# Altium project STM32_MICROCONTROLLER.PrjPcb
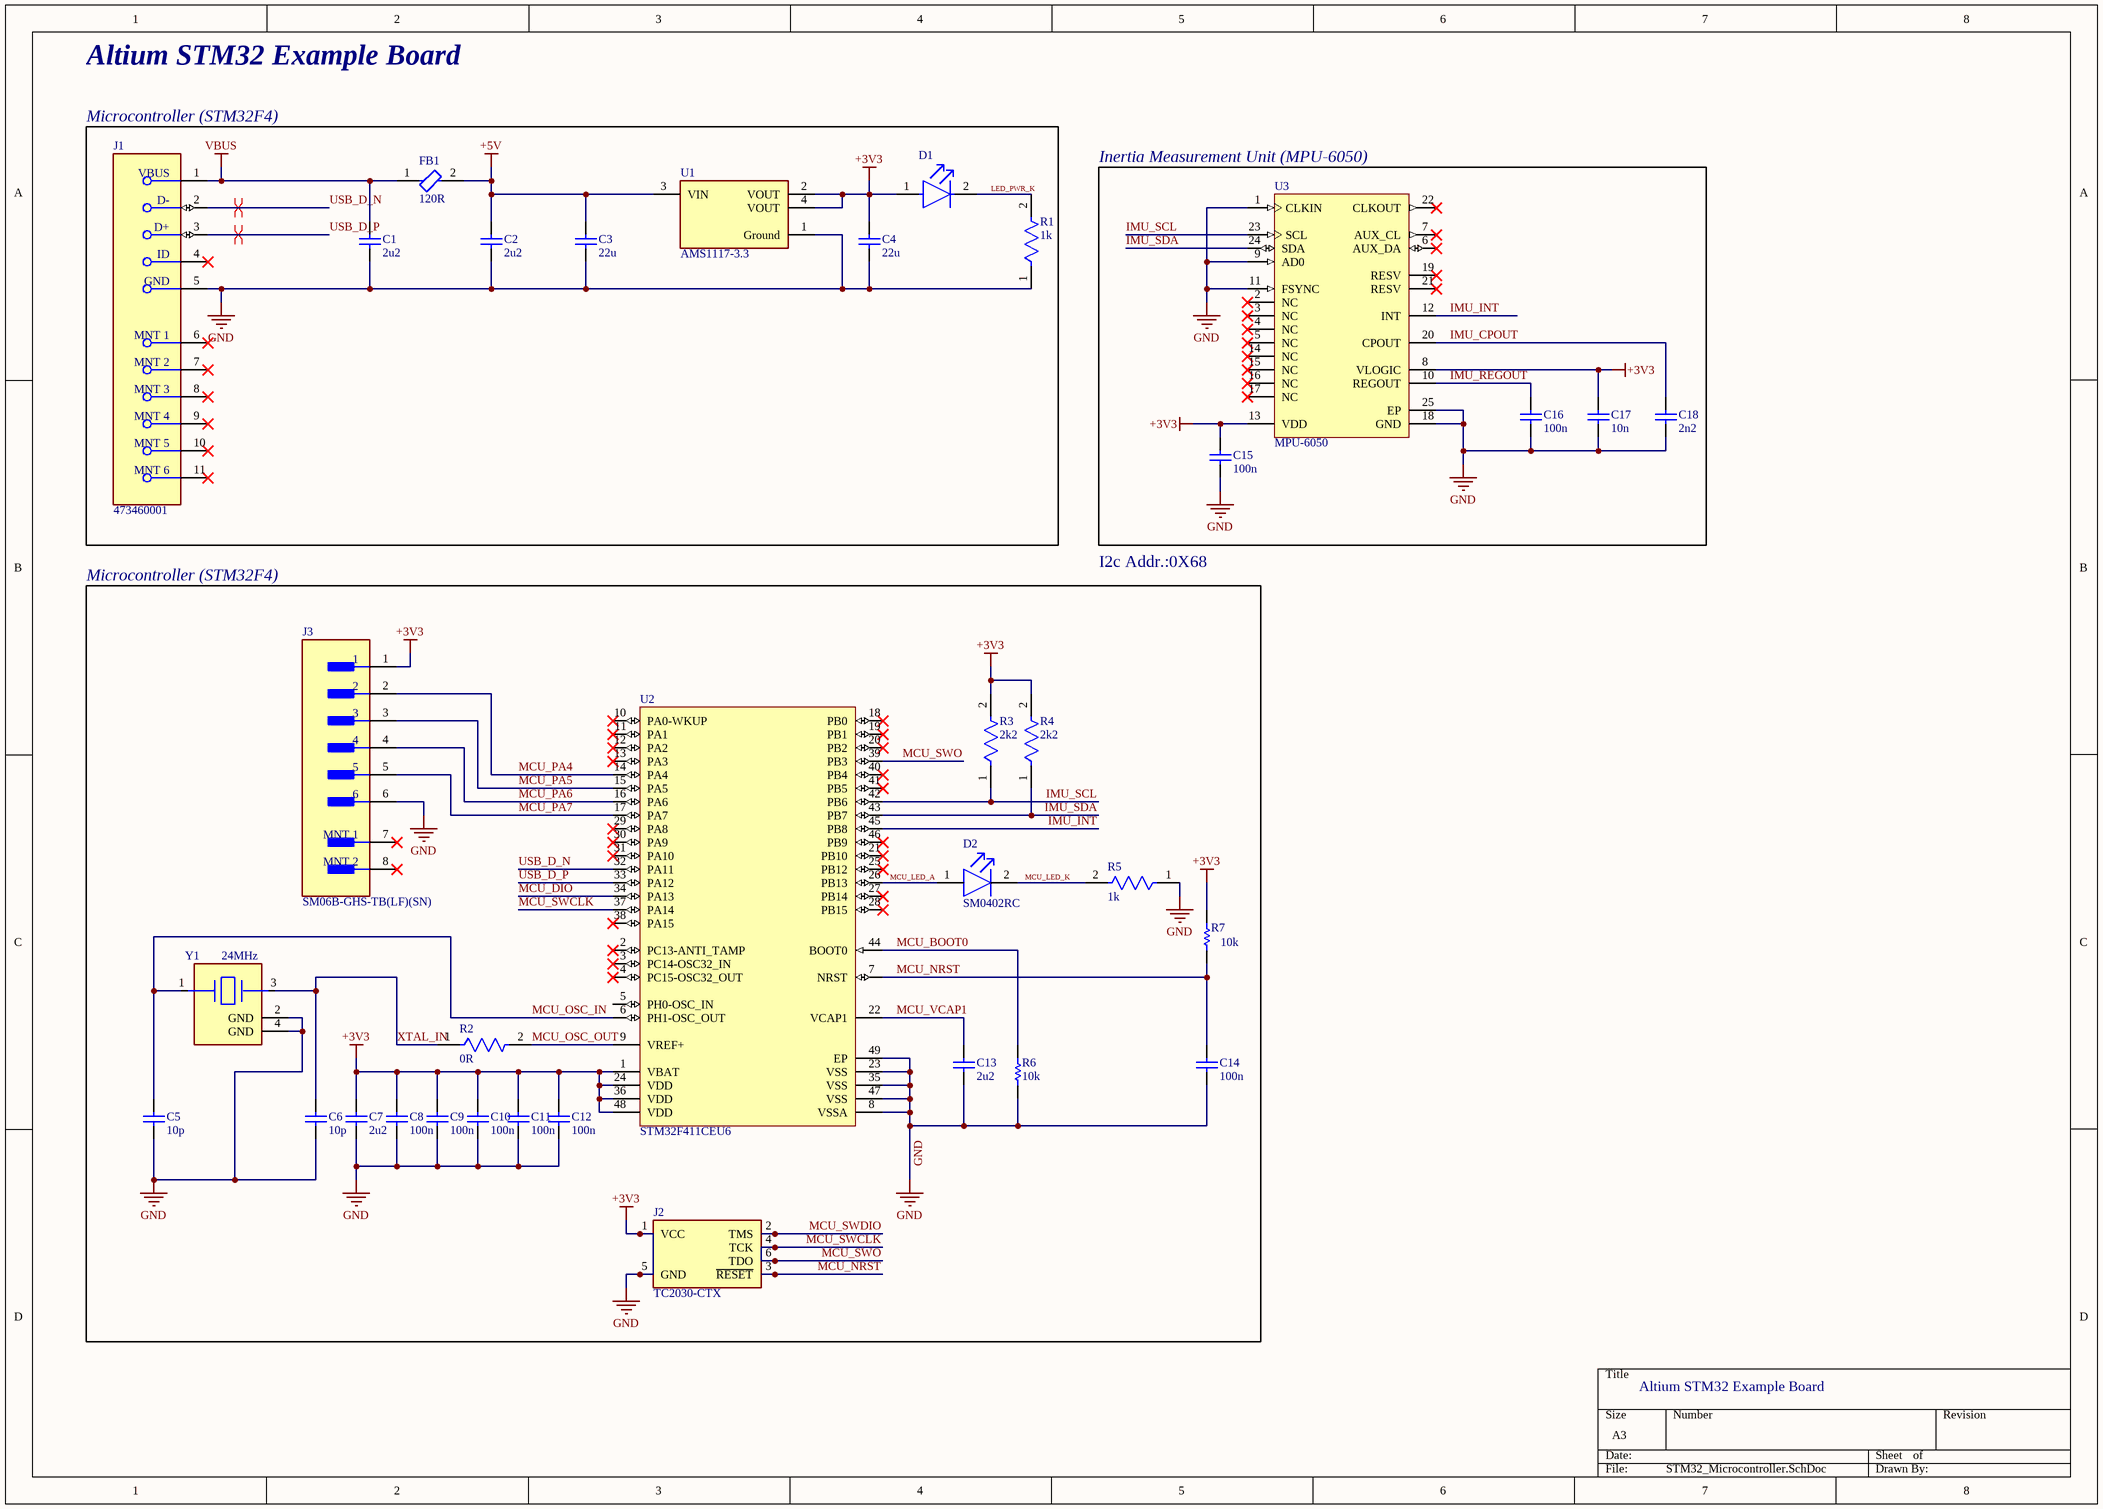
[diagram p0: STM32_Microcontroller.SchDoc]
1 sheet, 35 parts. Net scope: global (net labels, ports and power ports of the same name join across sheets).
Board file: STM32_MICROCONTROLLER.PcbDoc

## Sheet STM32_Microcontroller.SchDoc
size A3; SheetNumber: 1; SheetTotal: 1

### Parts
C1  2u2  [CAPC1608X95X40ML15T15]
C2  2u2  [CAPC1608X95X40ML15T15]
C3  22u  [CAPC2013X140X50NL20T25]
C4  22u  [CAPC2013X140X50NL20T25]
C5  10p  [CAPC1005X60X30NL05T10]
C6  10p  [CAPC1005X60X30NL05T10]
C7  2u2  [CAPC1608X95X40ML15T15]
C8  100n  [CAPC1005X56X25LL10T15]
C9  100n  [CAPC1005X56X25LL10T15]
C10  100n  [CAPC1005X56X25LL10T15]
C11  100n  [CAPC1005X56X25LL10T15]
C12  100n  [CAPC1005X56X25LL10T15]
C13  2u2  [CAPC1608X95X40ML15T15]
C14  100n  [CAPC1005X56X25LL10T15]
C15  100n  [CAPC1005X56X25LL10T15]
C16  100n  [CAPC1005X56X25LL10T15]
C17  10n  [CAPC1005X56X25LL10T15]
C18  2n2  [CAPC1005X56X25LL10T15]
D1  SM0402GC  [FP-SM0402GC-MFG]  (value not drawn)
D2  SM0402RC  [FP-SM0402RC-MFG]
FB1  120R  [FP-BLM18-0_15-t0_8-IPC_B]
J1  473460001  [FP-473460001-MFG]
J2  TC2030-CTX  [TC2030-IDC-NL]
J3  SM06B-GHS-TB(LF)(SN)  [FP-SM06B-GHS-TB_LF_SN-MFG]
R1  1k  [FP-RMCF0402-IPC_A]
R2  0R  [FP-RMCF0402-IPC_A]
R3  2k2  [FP-RMCF0402-IPC_A]
R4  2k2  [FP-RMCF0402-IPC_A]
R5  1k  [FP-RMCF0402-IPC_A]
R6  10k  [RESC1005X40X25LL10T10]
R7  10k  [RESC1005X40X25LL10T10]
U1  AMS1117-3.3  [FP-AMS1117-IPC_C]
U2  STM32F411CEU6  [STM-UFQFPN48_L]
U3  MPU-6050  [IS-QFN-24_V]
Y1  24MHz  [FP-TSX-3225-MFG]

### Blocks framed on the sheet
Microcontroller (STM32F4): C1-C4 D1 FB1 J1 R1 U1
Inertia Measurement Unit (MPU-6050): C15-C18 U3

### Nets
+5V: C2.2 C3.2 FB1.2 U1.3(VIN)
GND: C1.1 C2.1 C3.1 C4.1 C4.2 C5.1 C6.1 C7.1 C7.2 C8.1 C8.2 C9.1 C9.2 C10.1 C10.2 C11.1 C11.2 C12.1 C12.2 C13.1 C14.1 C15.1 C15.2 C16.1 C17.1 C17.2 C18.2 D1.1(A) J1.5(GND) J2.1(VCC) J2.5(GND) J3.1 J3.6 R1.1 R3.2 R4.2 R5.1 R6.1 R7.2 U1.1(Ground) U1.2(VOUT) U1.4(VOUT) U2.1(VBAT) U2.8(VSSA) U2.23(VSS) U2.24(VDD) U2.35(VSS) U2.36(VDD) U2.47(VSS) U2.48(VDD) U2.49(EP) U3.1(CLKIN) U3.8(VLOGIC) U3.9(AD0) U3.11(FSYNC) U3.13(VDD) U3.18(GND) U3.25(EP) Y1.2(GND) Y1.4(GND)  [also labelled +3V3]
VBUS: C1.2 FB1.1 J1.1(VBUS)
IMU_CPOUT: C18.1 U3.20(CPOUT)
IMU_INT: U2.45(PB8) U3.12(INT)
IMU_REGOUT: C16.2 U3.10(REGOUT)
IMU_SCL: R3.1 U2.42(PB6) U3.23(SCL)
IMU_SDA: R4.1 U2.43(PB7) U3.24(SDA)
LED_PWR_K: D1.2(C) R1.2
MCU_BOOT0: R6.2 U2.44(BOOT0)
MCU_DIO: U2.34(PA13)
MCU_LED_A: D2.1(A) U2.26(PB13)
MCU_LED_K: D2.2(C) R5.2
MCU_NRST: C14.2 J2.3(~{RESET}) R7.1 U2.7(NRST)
MCU_OSC_IN: C5.2 U2.6(PH1-OSC_OUT) Y1.1
MCU_OSC_OUT: R2.2 U2.9(VREF+)
MCU_PA4: J3.2 U2.14(PA4)
MCU_PA5: J3.3 U2.15(PA5)
MCU_PA6: J3.4 U2.16(PA6)
MCU_PA7: J3.5 U2.17(PA7)
MCU_SWCLK: J2.4(TCK) J2.6(TDO) U2.37(PA14) U2.39(PB3)  [also labelled MCU_SWO]
MCU_SWDIO: J2.2(TMS)
MCU_VCAP1: C13.2 U2.22(VCAP1)
USB_D_N: J1.2(D-) U2.32(PA11)
USB_D_P: J1.3(D+) U2.33(PA12)
XTAL_IN: C6.2 R2.1 Y1.3

Not connected (* = marked no-connect by the designer): J1 4(ID)* 6(MNT_1)* 7(MNT_2)* 8(MNT_3)* 9(MNT_4)* 10(MNT_5)* 11(MNT_6)*; J3 7(MNT_1)* 8(MNT_2)*; U2 2(PC13-ANTI_TAMP)* 3(PC14-OSC32_IN)* 4(PC15-OSC32_OUT)* 5(PH0-OSC_IN) 10(PA0-WKUP)* 11(PA1)* 12(PA2)* 13(PA3)* 18(PB0)* 19(PB1)* 20(PB2)* 21(PB10)* 25(PB12)* 27(PB14)* 28(PB15)* 29(PA8)* 30(PA9)* 31(PA10)* 38(PA15)* 40(PB4)* 41(PB5)* 46(PB9)*; U3 2(NC)* 3(NC)* 4(NC)* 5(NC)* 6(AUX_DA)* 7(AUX_CL)* 14(NC)* 15(NC)* 16(NC)* 17(NC)* 19(RESV)* 21(RESV)* 22(CLKOUT)*

### Layout directives
differential pair; differential pair class DIFF_USB: USB_D_N, USB_D_P

### Notes on the sheet
- Altium STM32 Example Board
- Microcontroller (STM32F4)
- I2c Addr.:0X68

### Library data of the parts
C1 C2 C7 C13 = CMP-2006-01685-1: Part Number: VJ0603A270JXJPW1BC; Manufacturer: Vitramon
C3 C4 = CMP-2007-03253-1: Manufacturer: Kemet; Part Number: C0805C185K4RACTU
C5 C6 = CMP-2008-02128-1: Part Number: C0402C103K4RALTU; Manufacturer: Kemet
C8-C12 C14-C18 = CMP-2008-02962-1: Part Number: 0402YC392KAT2A; Manufacturer: AVX Interconnect / Elco
D1 = CMP-35283-000001-2: LED GREEN CLEAR 0402 SMD; Lens Size: 1mm; Luminous Intensity: 28.5mcd; Viewing Angle: 130°; Forward Voltage: 1.9V; Test Current: 20mA; Lens Color: Colorless; Lens Style: Flat; Dominant Wavelength: 572nm; Case Code (Metric): 1005; Mount: Surface Mount; Case Code (Imperial): 0402; Length: 1mm; Width: 0.5mm; Case/Package: 0402; Lens Transparency: Clear; Height: 0.71mm; Packaging: Tape and Reel; Color: Green
D2 = CMP-35283-000003-1: LED RED CLEAR 0402 SMD; Test Current: 20mA; Luminous Intensity: 90mcd; Lens Color: Colorless; Lens Style: Flat; Lens Size: 1mm; Forward Voltage: 2.1V; Viewing Angle: 130°; Dominant Wavelength: 631nm; Width: 0.5mm; Length: 1mm; Packaging: Tape and Reel; Height: 0.71mm; Lens Transparency: Clear; Case Code (Imperial): 0402; Case/Package: 0402; Mount: Surface Mount; Case Code (Metric): 1005; Color: Red
FB1 = CMP-06046-002640-1: Chip Ferrite Bead, 0603, 330Ω @ 100MHz, 0.58Ω, 25%, 400mA; RoHS Compliant: Yes
J1 = CMP-2000-05246-2: CONN RCPT USB2.0 MICRO B SMD R/A; Manufacturer: Molex; Conn Orientation: Right Angle; Is Female: yes; Shielding: true; Pitch: 0.65mm; Number Of Contacts: 5; Voltage Rating: 30V; Current Rating: 1.8A; Device Class L2: USB Connectors; Digikey Description: CONN RCPT USB2.0 MICRO B SMD R/A; Height: 2.945mm; RoHS: TRUE; ComponentLink2Description: Datasheet; Octopart: https://octopart.com/47346-0001-molex-7164928; Automotive: No; Package: 0; Category: Conn; Device Class L1: Connectors; Usb Standard: USB 2.0; Temperature: -30°C to +85°C; Temperature Range Low: -30°C; Footprint Url: https://www.molex.com/pdm_docs/sd/473460001_sd.pdf; ComponentLink2URL: https://www.molex.com/webdocs/datasheets/pdf/en-us/0473460001_IO_CONNECTORS.pdf; Lead Free: Yes; Manufacturer Part Number: 473460001; Contact Material: Gold,Nickel; Temperature Range High: +85°C; Device Class L3: unset
J2 = TC2030-CTX: CortexÂ® Plug-Of-Nailsâ„¢ Adapter Cable; MF: Tag-Connect LLC; Availability: Unavailable; Package: None; MP: TC2030-CTX; SnapEDA_Link: https://www.snapeda.com/parts/TC2030-CTX/Tag-Connect%20LLC/view-part/225831/?ref=snap; Value: *; Price: None
J3 = CMP-17439-000061-1: CONN HEADER SMD R/A 6POS 1.25MM; Number of Contacts: 6; Voltage Rating: 50V; Current Rating: 1A; Connector Type: Outer Shroud Contact; Contact Resistance: 50mR; Orientation: Right Angle; Max Operating Temperature: 85°C; Mount: Surface Mount; Packaging: Tape and Reel; Contact Plating: Tin; Depth: 4.05mm; Max Voltage Rating (AC): 50V; Lead Free: Lead Free; Pitch: 1.25mm; Number of Positions: 6; Max Current Rating: 1A; Termination: Solder; Min Operating Temperature: -25°C; Housing Color: Beige; Fastening Type: Ramp; Length: 10.75mm; Color: Natural; Contact Material: Bronze; Housing Material: Polyamide; Number of Rows: 1
R1 R3-R5 = CMP-26527-000517-1: 5.1MΩ ±5% 0.063W 0402 Thick Film Chip Resistor AEC-Q200 compliant; Max Power Dissipation: 63mW; Temperature Coefficient: 200ppm/°C; Resistance: 5.1MR; Width: 0.02inch; Max Operating Temperature: 155°C; RoHS Compliant: Yes; Radiation Hardening: No; Case Code (Metric): 1005; Packaging: Tape and Reel; Resistor Type: Thick Film; Min Operating Temperature: -55°C; Height: 0.016inch; Length: 0.039inch; Mount: Surface Mount; Series: RMCF; Features: Automotive AEC-Q200; Case Code (Imperial): 0402; Tolerance: 5%; Contact Plating: Tin; Case/Package: 0402; Number of Terminations: 2
R2 = CMP-26527-005447-1: 2.7MΩ ±5% 0.063W 0402 Thick Film Chip Resistor AEC-Q200 compliant; Resistance: 2.7MR; Temperature Coefficient: 200ppm/°C; Max Power Dissipation: 63mW; Min Operating Temperature: -55°C; Length: 0.039inch; Mount: Surface Mount; RoHS Compliant: Yes; Series: RMCF; Number of Terminations: 2; Features: Automotive AEC-Q200; Packaging: Cut Tape; Max Operating Temperature: 155°C; Width: 0.02inch; Package Quantity: 1; Case Code (Imperial): 0402; Case Code (Metric): 1005; Contact Plating: Tin; Height: 0.016inch; Tolerance: 5%; Resistor Type: Thick Film; Case/Package: 0402
R6 R7 = CMP-2002-04584-1: Manufacturer: KOA Speer; Part Number: SG73P1ETTP1002F
U1 = CMP-209535-000001-1: LDO Voltage Regulators 1A, 3.3V; Manufacturer: Advanced Monolithic Systems; Dropout Voltage: 1.1V; Output Type: Fixed; Nominal Supply Current: 5mA; Max Power Dissipation: 1.2W; Max Supply Voltage: 15V; Number Of Outputs: 1; Standoff Height: 0.64mm; Max Junction Temp: +125°C; Height: 1.8mm; Package: AMS1117; Device Class L2: Power Management ICs; ComponentLink2Description: Datasheet; ComponentLink2URL: http://www.advanced-monolithic.com/pdf/ds1117.pdf; Category: IC; RoHS: TRUE; Automotive: No; Device Class L1: Integrated Circuits (ICs); Output Current: 1A; Device Class L3: Voltage Regulators - Linear; Temperature: -40°C to +125°C; Output Voltage: 3.3V; Manufacturer Part Number: AMS1117-3.3; Temperature Range Low: -40°C; Octopart: https://octopart.com/ams1117-3.3-advanced+monolithic+systems-25899300; Lead Free: Yes; Ipc Land Pattern Name: SOT229P700X180-4; Temperature Range High: +125°C
U2 = CMP-0243-00165-1: ARM Cortex-M4 32-bit MCU+FPU, 512 KB Flash, 128 KB RAM, 36 I/Os, 48-Pin UFQFPN, -40 to 85 degC, Tray; Operating Frequency(F) (Processor speed) (MHz): 100; FLASH Size (Prog) (kB): 512; Internal RAM Size (kB): 128; I/Os (High Current): 36; Supply Voltage(Vcc) min (V): 1.7; Package Reference: 48-Pin Ultra Thin Fine Pitch Quad Flat No-Lead, 7 x 7 x 0.6 mm Body, 0.5 mm Pitch, Exposed Pad; ComponentLink1Description: Manufacturer URL; ComponentLink1URL: http://www.st.com/; Packing: Tray; Package Description: UFQFPN48; Core: ARM Cortex-M4; ComponentLink2Description: Datasheet; ComponentLink2URL: http://www.st.com/st-web-ui/static/active/en/resource/technical/document/datasheet/DM00115249.pdf; DatasheetVersion: Rev. 6; Mounting Technology: Surface Mount
U3 = CMP-1753-00002-2: 3-Axis Gyroscope, Accelerometer and a Digital Motion Processor(TM) (DMP), 2.375 to 3.46 V, -40 to 85 degC, 24-Pin QFN, RoHS, Tape and Reel; Manufacturer: InvenSense; Featured Product: MPU-60506-Axis,IntegratedI²CSolution; Other Names: 1428-1007-2 / MPU6050; Sensor Type: MotionTracking; Online Catalog: MPU-6000™Series; Unit PriceUSD: Digital; Datasheet Version: Rev. 3.3, 05/2012; Category: Sensors,Transducers; Datasheet URL: http://datasheet.octopart.com/MPU-6050-InvenSense-datasheet-14421344.pdf; Family: Multifunction; Standard Package: 5,000; Manufacturer URL: http://www.invensense.com/; Output Type: Digital; Dynamic Catalog: MPU-6000™Series
Y1 = CMP-36405-000018-1: CRYSTAL 24.0000MHZ 9PF SMD; ESR (Equivalent Series Resistance): 40R; Frequency Stability: 20ppm; Tolerance: 10ppm; Drive Level: 200uW; Min Operating Temperature: -40°C; RoHS Compliant: Yes; Width: 2.5mm; Max Operating Temperature: 105°C; Package Quantity: 250; Load Capacitance: 9pF; Mount: Surface Mount; Lead Free: Lead Free; Height: 0.024inch; Depth: 2.5mm; Frequency: 24MHz; Packaging: Tape and Reel; Series: TSX-3225; Weight: 0.000564oz; Number of Pins: 4; Termination: SMD/SMT; Case/Package: SMD/SMT; Length: 3.2mm; Frequency Tolerance: 10ppm